# Altium schematic sheet SDCARD.SchDoc
size A4
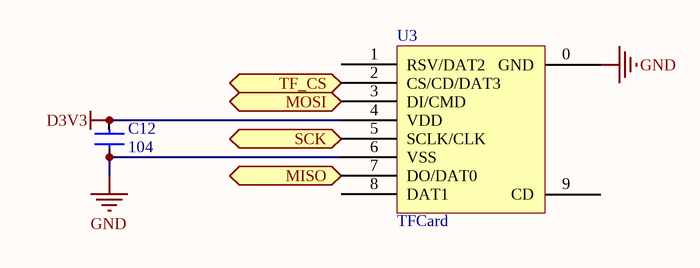
[diagram p0: SDCARD.SchDoc]

## Parts
C12  104  [0603C]
U3  TFCard  [TF-2]

## Ports
MISO, MOSI, SCK (in), TF_CS (bidir)

## Nets
D3V3: C12.1 U3.4(VDD)
GND: C12.2 U3.0(GND) U3.6(VSS)
MISO: U3.7(DO/DAT0) ; port MISO
MOSI: U3.3(DI/CMD) ; port MOSI
SCK: U3.5(SCLK/CLK) ; port SCK
TF_CS: U3.2(CS/CD/DAT3) ; port TF_CS

Not connected (* = marked no-connect by the designer): U3 1(RSV/DAT2) 8(DAT1) 9(CD)

## Library data of the parts
C12 = CAP: 普通小电容